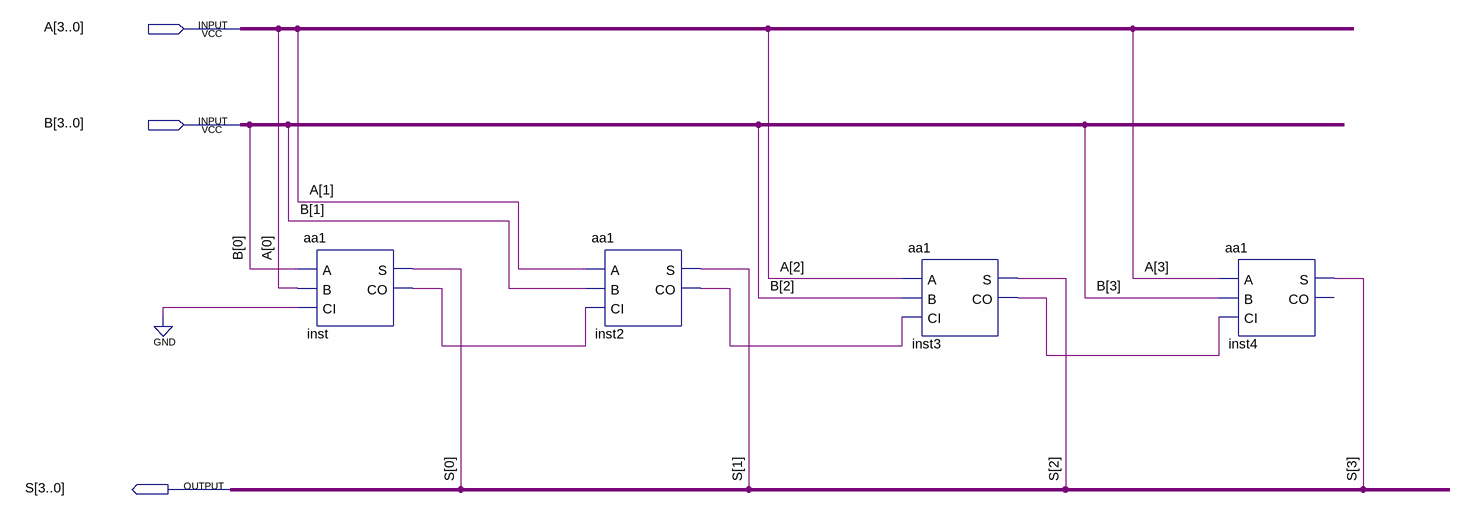
[diagram p0: schematic sheet]
// Quartus schematic aa2.bdf as structural Verilog: 4 symbols, 3 pins
module aa2 (
  input  [3:0] A,
  input  [3:0] B,
  output [3:0] S
);

  wire inst2_co, inst3_co, inst_co;

  aa1 inst (.A(B[0]), .B(A[0]), .CI(1'b0), .S(S[0]), .CO(inst_co));
  aa1 inst2 (.A(A[1]), .B(B[1]), .CI(inst_co), .S(S[1]), .CO(inst2_co));
  aa1 inst3 (.A(A[2]), .B(B[2]), .CI(inst2_co), .S(S[2]), .CO(inst3_co));
  aa1 inst4 (.A(A[3]), .B(B[3]), .CI(inst3_co), .S(S[3]));  // open: CO
endmodule
